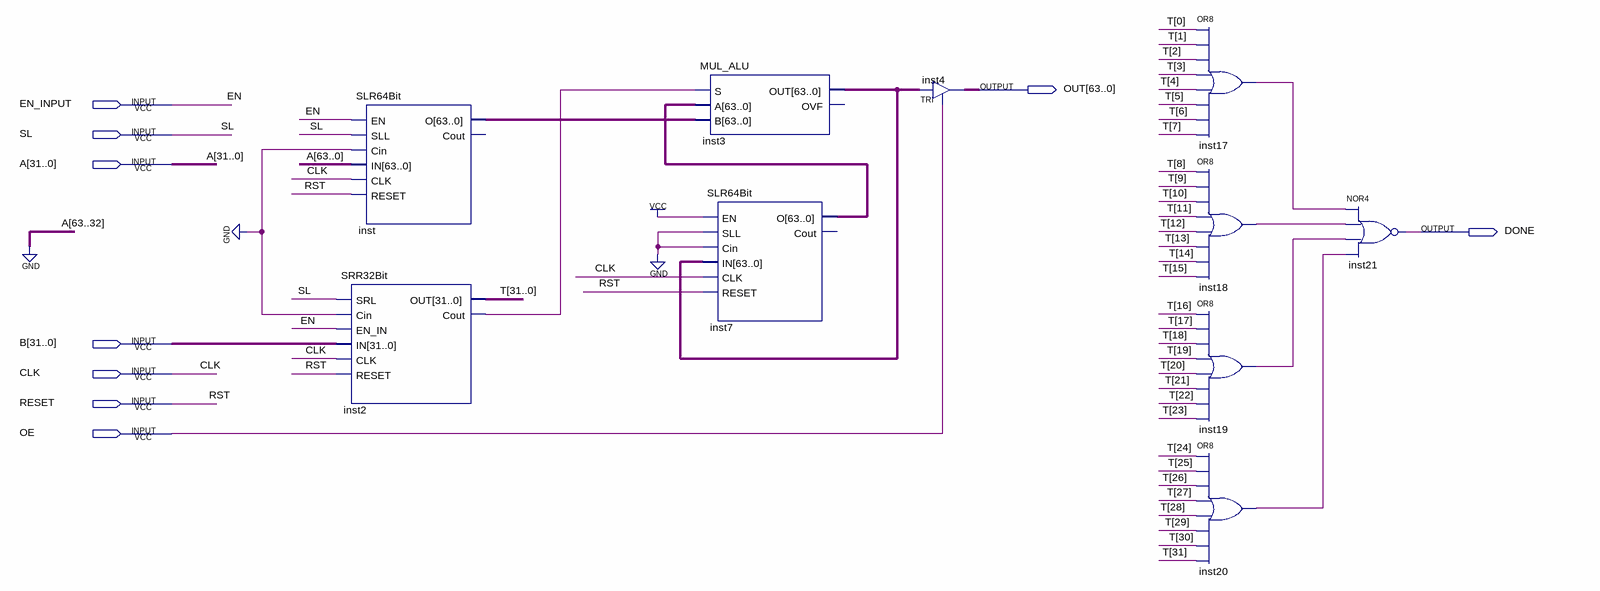
[diagram p0: schematic sheet]
// Quartus schematic MUL2.bdf as structural Verilog: 10 symbols, 9 pins
module MUL2 (
  input  EN_INPUT,
  input  SL,
  input  [31:0] A,
  input  [31:0] B,
  input  CLK,
  input  RESET,
  input  OE,
  output [63:0] OUT,
  output DONE
);

  wire inst2_cout, inst17_out, inst18_out, inst19_out, inst20_out;
  wire [31:0] T;
  wire [63:0] inst3_out, inst7_o, inst_o;

  SLR64Bit inst (
    .EN(EN_INPUT), .SLL(SL), .Cin(1'b0), .IN({{32{1'b0}}, A}), .CLK(CLK), .RESET(RESET), .O(inst_o));  // open: Cout
  SRR32Bit inst2 (.SRL(SL), .Cin(1'b0), .EN_IN(EN_INPUT), .IN(B), .CLK(CLK), .RESET(RESET), .OUT(T), .Cout(inst2_cout));
  MUL_ALU inst3 (.S(inst2_cout), .A(inst7_o), .B(inst_o), .OUT(inst3_out));  // open: OVF
  SLR64Bit inst7 (
    .EN(1'b1), .SLL(1'b0), .Cin(1'b0), .IN(inst3_out), .CLK(CLK), .RESET(RESET), .O(inst7_o));  // open: Cout
  TRI inst4[63:0] (.IN(inst3_out), .OE(OE), .OUT(OUT));
  or inst17 (inst17_out, T[0], T[1], T[2], T[3], T[4], T[5], T[6], T[7]);
  or inst18 (inst18_out, T[8], T[9], T[10], T[11], T[12], T[13], T[14], T[15]);
  or inst19 (inst19_out, T[16], T[17], T[18], T[19], T[20], T[21], T[22], T[23]);
  or inst20 (inst20_out, T[24], T[25], T[26], T[27], T[28], T[29], T[30], T[31]);
  nor inst21 (DONE, inst17_out, inst18_out, inst19_out, inst20_out);

  // Other names for the same wires on the sheet: EN = EN_INPUT; RST = RESET
endmodule
